# Altium schematic sheet [08] - PERIPHERALS.SchDoc
size A4
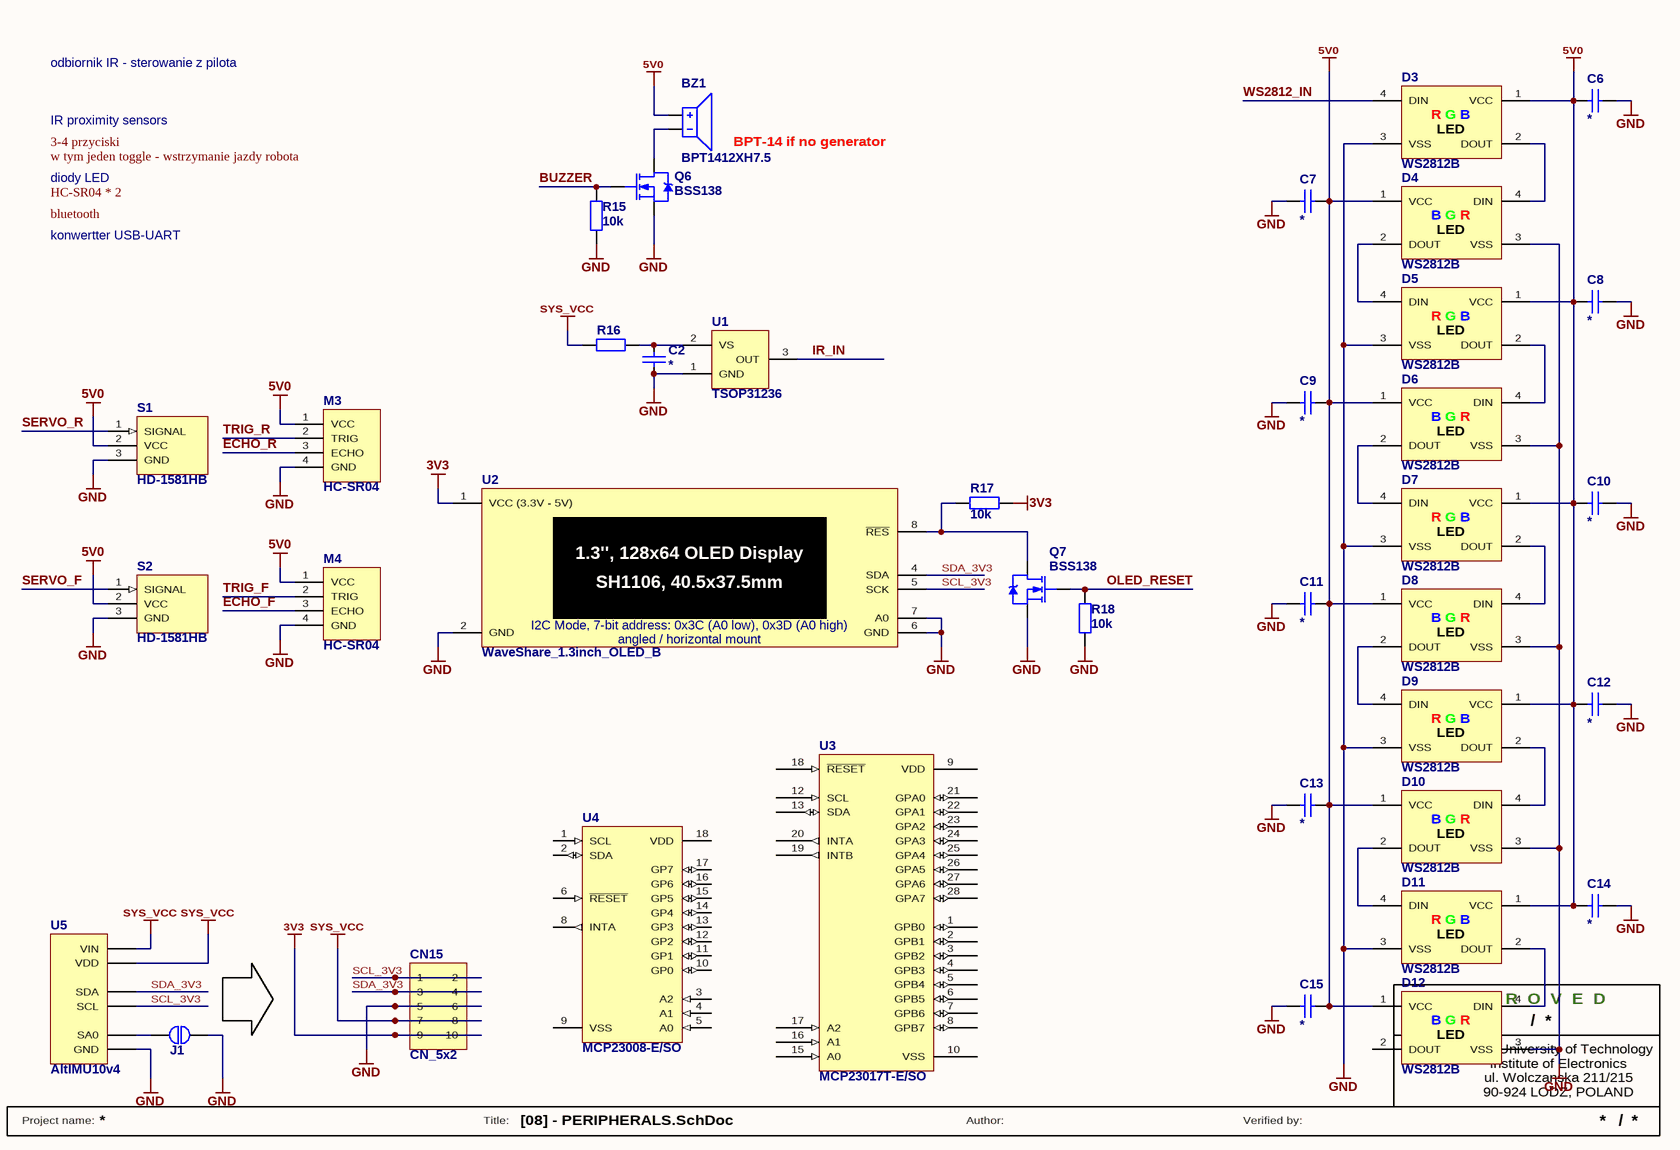
[diagram p0: [08] - PERIPHERALS.SchDoc]

## Parts
BZ1  BPT1412XH7.5  [BUZ-13,8-7,6]
C2  *  [C1206]
C6  *  [C0805]
C7  *  [C0805]
C8  *  [C0805]
C9  *  [C0805]
C10  *  [C0805]
C11  *  [C0805]
C12  *  [C0805]
C13  *  [C0805]
C14  *  [C0805]
C15  *  [C0805]
CN15  CN_5x2  [GP_5x2H_F]
D3  WS2812B  [WS2812B]
D4  WS2812B  [WS2812B]
D5  WS2812B  [WS2812B]
D6  WS2812B  [WS2812B]
D7  WS2812B  [WS2812B]
D8  WS2812B  [WS2812B]
D9  WS2812B  [WS2812B]
D10  WS2812B  [WS2812B]
D11  WS2812B  [WS2812B]
D12  WS2812B  [WS2812B]
J1  Open  [JMP2_0603_NO]  (value not drawn)
M3  HC-SR04  [HC-SR04]
M4  HC-SR04  [HC-SR04]
Q6  BSS138  [SOT-23]
Q7  BSS138  [SOT-23]
R15  10k  [R0603]
R16  (no value)  [R0603]
R17  10k  [R0603]
R18  10k  [R0603]
S1  HD-1581HB  [HD-1581HB]
S2  HD-1581HB  [HD-1581HB]
U1  TSOP31236  [TSOP312 / TSOP314]
U2  WaveShare_1.3inch_OLED_B  [WaveShare_1.3INCH_OLED]
U3  MCP23017T-E/SO  [SO28]
U4  MCP23008-E/SO  [SO18W]
U5  AltIMU10v4  [AltIMU-10 v4]

## Nets
3V3: CN15.9 CN15.10 R17.2 U2.1(VCC_(3.3V_-_5V))
5V0: BZ1.1 C6.1 C7.2 C8.1 C9.2 C10.1 C11.2 C12.1 C13.2 C14.1 C15.2 D3.1(VCC) D4.1(VCC) D5.1(VCC) D6.1(VCC) D7.1(VCC) D8.1(VCC) D9.1(VCC) D10.1(VCC) D11.1(VCC) D12.1(VCC) M3.1(VCC) M4.1(VCC) S1.2(VCC) S2.2(VCC)
GND: C2.1 C6.2 C7.1 C8.2 C9.1 C10.2 C11.1 C12.2 C13.1 C14.2 C15.1 CN15.5 CN15.6 D3.3(VSS) D4.3(VSS) D5.3(VSS) D6.3(VSS) D7.3(VSS) D8.3(VSS) D9.3(VSS) D10.3(VSS) D11.3(VSS) D12.3(VSS) J1.1 M3.4(GND) M4.4(GND) Q6.2(S) Q7.2(S) R15.2 R18.2 S1.3(GND) S2.3(GND) U1.1(GND) U2.2(GND) U2.6(GND) U2.7(A0) U5.1(GND)
SYS_VCC: CN15.7 CN15.8 R16.1 U5.3(VIN) U5.4(VDD)
BUZZER: Q6.1(G) R15.1
ECHO_F: M4.3(ECHO)
ECHO_R: M3.3(ECHO)
IR_IN: U1.3(OUT)
OLED_RESET: Q7.1(G) R18.1
SCL_3V3: CN15.1 CN15.2 U2.5(SCK) U5.6(SCL)
SDA_3V3: CN15.3 CN15.4 U2.4(SDA) U5.5(SDA)
SERVO_F: S2.1(SIGNAL)
SERVO_R: S1.1(SIGNAL)
TRIG_F: M4.2(TRIG)
TRIG_R: M3.2(TRIG)
WS2812_IN: D3.4(DIN)
NetBZ1_2: BZ1.2 Q6.3(D)
NetC2_2: C2.2 R16.2 U1.2(VS)
NetD3_2: D3.2(DOUT) D4.4(DIN)
NetD4_2: D4.2(DOUT) D5.4(DIN)
NetD5_2: D5.2(DOUT) D6.4(DIN)
NetD6_2: D6.2(DOUT) D7.4(DIN)
NetD7_2: D7.2(DOUT) D8.4(DIN)
NetD8_2: D8.2(DOUT) D9.4(DIN)
NetD9_2: D9.2(DOUT) D10.4(DIN)
NetD10_2: D10.2(DOUT) D11.4(DIN)
NetD11_2: D11.2(DOUT) D12.4(DIN)
NetJ1_2: J1.2 U5.2(SA0)
NetQ7_3: Q7.3(D) R17.1 U2.8(~{RES})

Not connected (* = marked no-connect by the designer): D12 2(DOUT); U3 1(GPB0) 2(GPB1) 3(GPB2) 4(GPB3) 5(GPB4) 6(GPB5) 7(GPB6) 8(GPB7) 9(VDD) 10(VSS) 11(NC) 12(SCL) 13(SDA) 14(NC) 15(A0) 16(A1) 17(A2) 18(~{RESET}) 19(INTB) 20(INTA) 21(GPA0) 22(GPA1) 23(GPA2) 24(GPA3) 25(GPA4) 26(GPA5) 27(GPA6) 28(GPA7); U4 1(SCL) 2(SDA) 3(A2) 4(A1) 5(A0) 6(~{RESET}) 8(INTA) 9(VSS) 10(GP0) 11(GP1) 12(GP2) 13(GP3) 14(GP4) 15(GP5) 16(GP6) 17(GP7) 18(VDD)

## Notes on the sheet
- odbiornik IR - sterowanie z pilota
- IR proximity sensors
- (near BZ1) BPT-14 if no generator
- diody LED
- konwertter USB-UART
- Labels drawn without touching a wire or pin: 3-4 przyciski, bluetooth, HC-SR04 * 2, w tym jeden toggle - wstrzymanie jazdy robota
- REV:
- A  P  P  R  O  V  E  D
- /
- Lodz University of Technology
- ul. Wolczanska 211/215
- 90-924 LODZ, POLAND
- Institute of Electronics
- Project name:
- Title:
- Author:
- Verified by:
- (in symbol WaveShare_1.3inch_OLED) 1.3'', 128x64 OLED Display; SH1106, 40.5x37.5mm; I2C Mode, 7-bit address: 0x3C (A0 low), 0x3D (A0 high); angled / horizontal mount
- (in symbol WS2812B) R; G; B; LED

## Library data of the parts
BZ1 = BPT1412XH7.5: Piezoelectric Sound Transducer: 5Vp-p; 4kHz; O:14mm; with generator; Published: 24-Mar-1999; Revision: July-2002: Re-released for DXP Platform.; Publisher: Altium Limited
C2 C6-C15 = Cap: Capacitor; ComponentLink1Description: datasheet; ComponentLink2Description: supplier; Value: *
D3-D12 = WS2812B: Intelligent control LED integrated light source
J1 = JUMPER2_NO: Solder Jumper - Open
Q6 Q7 = BSS138: N-Channel Enhancement Mode Vertical DMOS FET; Published: 17-Dec-2003; DatasheetVersion: Mar-96; PackageVersion: 1996; PackageReference: SOT23; Publisher: Altium Limited; PackageDescription: SOT-23; 3 Leads; Body 3.1 x 2.5 mm, inc. leads (LxW max), Alternate Lead Configuration; ComponentLink1Description: Manufacturer Link; ComponentLink1URL: http://www.zetex.com/; ComponentLink2Description: Datasheet; ComponentLink2URL: www.zetex.com/3.0/pdf/BSS138.pdf
R15-R18 = Res: Resistor; Published: 19-Feb-2006; ComponentLink1Description: datasheet; ComponentLink2Description: supplier
  R15 R17 R18: Value: 10k
S1 S2 = HD-1581HB: HD-1581HB Micro Servo
U1 = TSOP31236: 36kHz IR Receiver Module for Remote Control Systems
U2 = WaveShare_1.3inch_OLED: DEP096032B-W OLED Display
U3 = MCP23017T-E/SO: 16-Bit I/O Expander with Serial Interface I2C, Extended Temp, SO28 Package
U4 = MCP23008-E/SO: 8-Bit I/O Expander with Serial Interface I2C, 18-Pin SOIC Package
U5 = AltIMU10v4: Pololu Gyro, Accelerometer, Compass, and Altimeter (L3GD20H, LSM303D, and LPS25H Carrier)